# EAGLE design LoRa Mini Dev v1.1 (EAGLE 7.5.0)
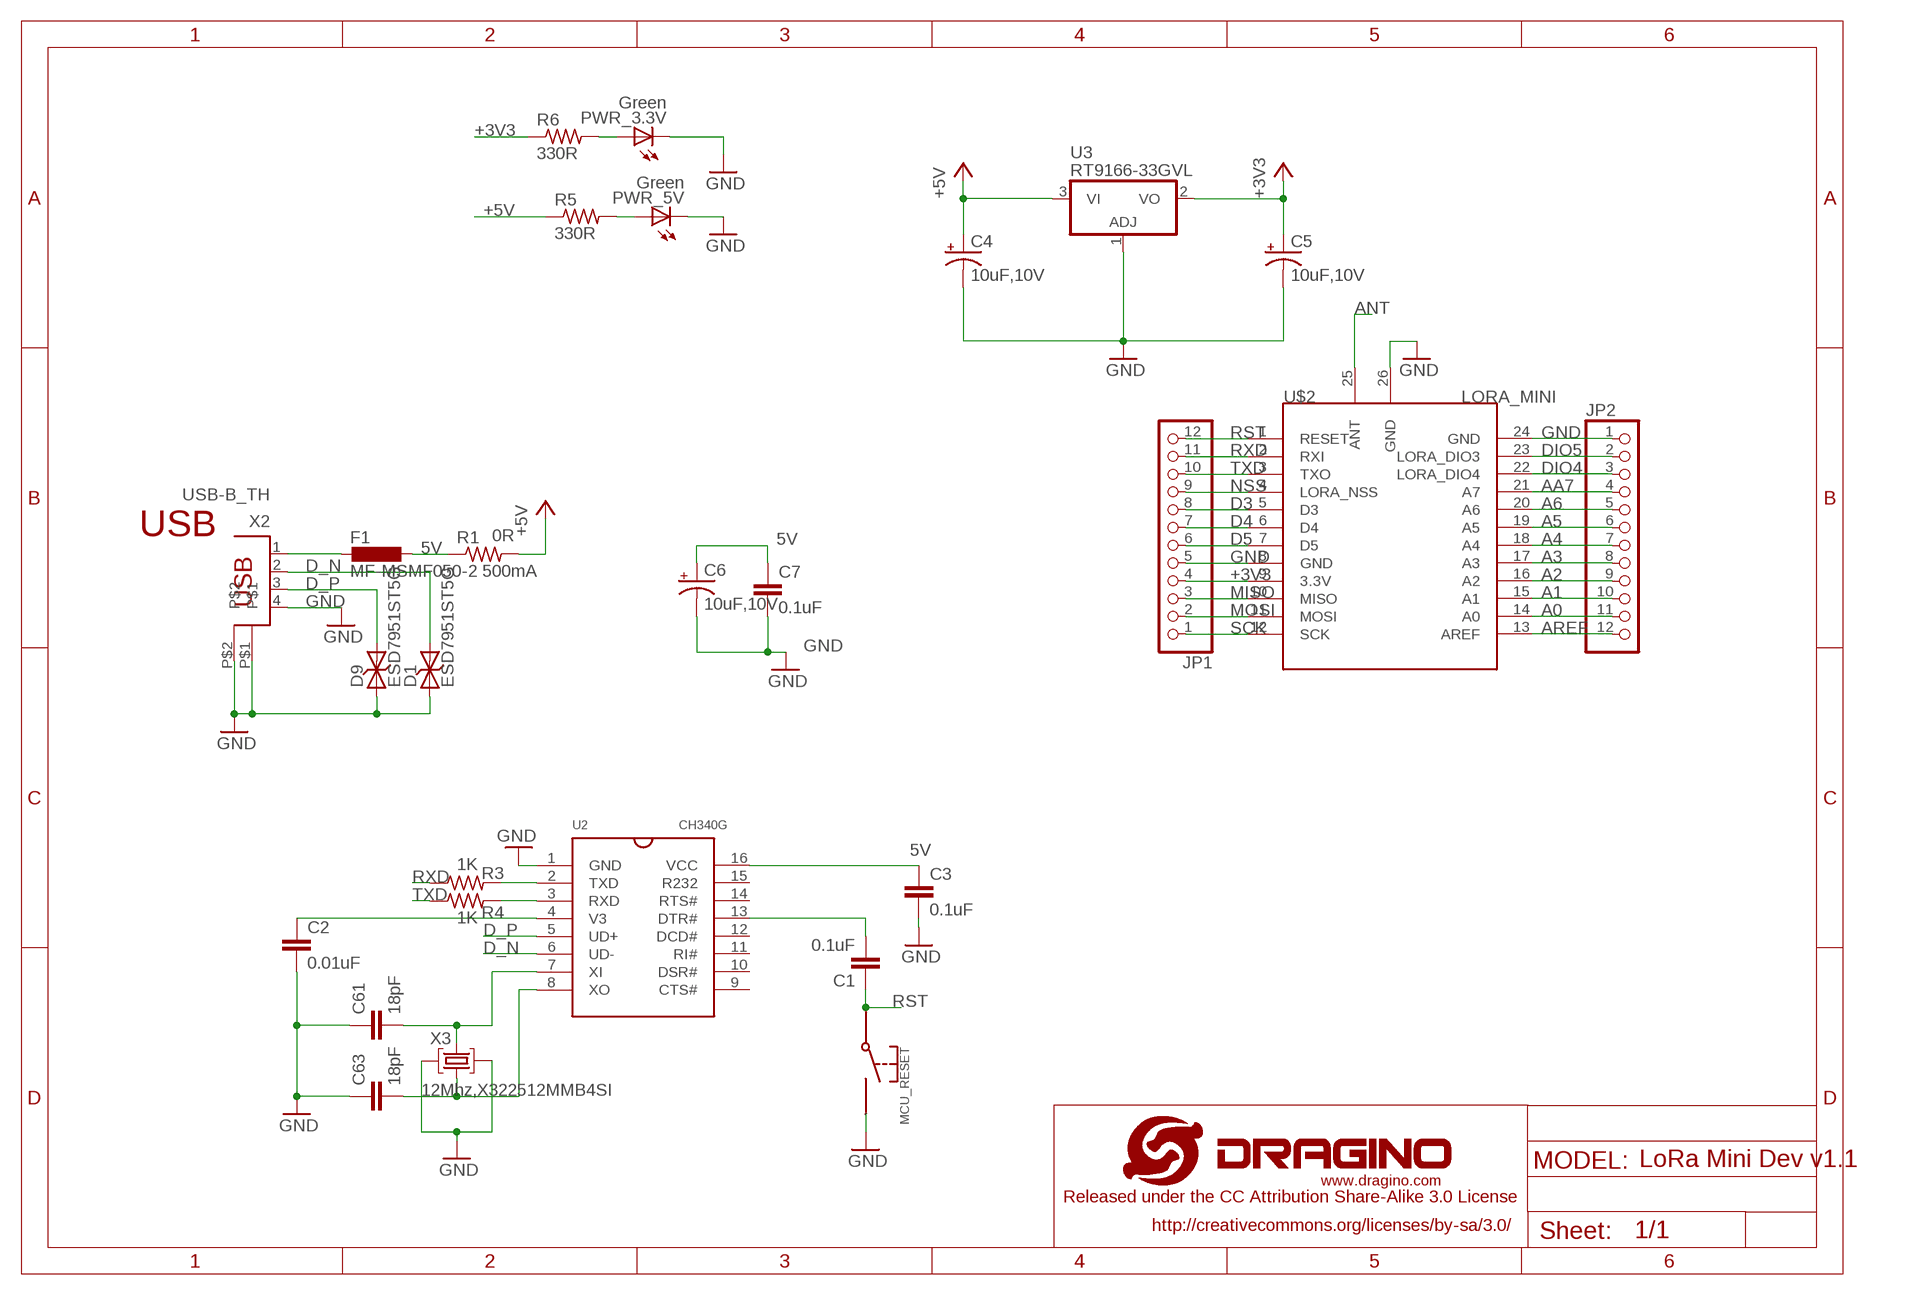
[diagram p0: schematic, sheet 1]

## Parts
C1  0.1uF  C-EUC0402  [C0402]
C2  0.01uF  C-EUC0402  [C0402]
C3  0.1uF  C-EUC0402  [C0402]
C4  10uF,10V  CPOL-USSMCA  [SMC_A]
C5  10uF,10V  CPOL-USSMCA  [SMC_A]
C6  10uF,10V  CPOL-USSMCA  [SMC_A]
C7  0.1uF  C-EUC0402  [C0402]
C61  18pF  C-EUC0402  [C0402]
C63  18pF  C-EUC0402  [C0402]
D1  ESD7951ST5G  TVSSOD−923  [SOD−923]
D9  ESD7951ST5G  TVSSOD−923  [SOD−923]
F1  MF-MSMF050-2 500mA  L-EUL1812  [L1812]
JP1  PINHD-1X12  [1X12]
JP2  PINHD-1X12  [1X12]
MCU_RESET  SWITCH  [SWITCH_3X6X5MM]
PWR_3.3V  Green  DRAGINO_LEDCHIPLED_0603  [DRAGINO_CHIPLED_0603]
PWR_5V  Green  DRAGINO_LEDCHIPLED_0603  [DRAGINO_CHIPLED_0603]
R1  0R  R-US_M0805  [M0805]
R3  1K  R-US_R0402  [R0402]
R4  1K  R-US_R0402  [R0402]
R5  330R  R-US_R0402  [R0402]
R6  330R  R-US_R0402  [R0402]
U2  CH340G  [CH340G]
U3  RT9166-33GVL  RT9166/A  [SOT23]
U$1  LOGO-NEW  [LOGO-SILK-NEW]
U$2  LORA_MINI  LORA_MINIB  [LORA_MINI_PCB]
X2  USB-B_TH  PN61729  [PN61729]
X3  12Mhz,X322512MMB4SI  CRYSTAL  [SMARTPRJ_CRYSTAL-3.2-2.5]

## Nets
5V: C3.1 C6.+ C7.1 F1.1 R1.1 U2.16(VCC)
+3V3: C5.+ JP1.4 R6.1 U3.2(VO) U$2.9(3.3V)
+5V: C4.+ R1.2 R5.1 U3.3(VI)
A0: JP2.11 U$2.14(A0)
A1: JP2.10 U$2.15(A1)
A2: JP2.9 U$2.16(A2)
A3: JP2.8 U$2.17(A3)
A4: JP2.7 U$2.18(A4)
A5: JP2.6 U$2.19(A5)
A6: JP2.5 U$2.20(A6)
AA7: JP2.4 U$2.21(A7)
ANT: U$2.25(ANT)
AREF: JP2.12 U$2.13(AREF)
CLK_N: C63.2 U2.8(XO) X3.1(C1)
CLK_P: C61.2 U2.7(XI) X3.3(C2)
D3: JP1.8 U$2.5(D3)
D4: JP1.7 U$2.6(D4)
D5 [gnd]: JP1.6 U$2.7(D5)
D_N: D1.P$2 U2.6(UD-) X2.2
D_P: D9.P$2 U2.5(UD+) X2.3
DIO4: JP2.3 U$2.22(LORA_DIO4)
DIO5: JP2.2 U$2.23(LORA_DIO3)
DTR: C1.2 U2.13(DTR#)
GND [gnd]: C2.2 C3.2 C4.- C5.- C6.- C7.2 C61.1 C63.1 D1.P$1 D9.P$1 JP1.5 JP2.1 MCU_RESET.P$2 PWR_3.3V.C PWR_5V.C U2.1(GND) U3.1(ADJ) U$2.8(GND) U$2.24(GND) U$2.26(GND) X2.4 X2.P$1 X2.P$2 X3.2(GND) X3.4(GND)
MISO: JP1.3 U$2.10(MISO)
MOSI: JP1.2 U$2.11(MOSI)
N$1: PWR_3.3V.A R6.2
N$2: F1.2 X2.1
N$5: R3.2 U2.2(TXD)
N$8: R4.2 U2.3(RXD)
N$9: PWR_5V.A R5.2
N$10: C2.1 U2.4(V3)
NSS: JP1.9 U$2.4(LORA_NSS)
RST: C1.1 JP1.12 MCU_RESET.P$1 U$2.1(RESET)
RXD: JP1.11 R3.1 U$2.2(RXI)
SCK: JP1.1 U$2.12(SCK)
TXD: JP1.10 R4.1 U$2.3(TXO)
Unconnected: U2.9(CTS#) U2.10(DSR#) U2.11(RI#) U2.12(DCD#) U2.14(RTS#) U2.15(R232)

## Notes on the sheet
- USB

## Library data of the parts
C1-C3 C7 C61 C63 = dragino-passive:C-EU: CAPACITOR, European symbol
C4-C6 = rcl:CPOL-US: POLARIZED CAPACITOR, American symbol
D1 D9 = dragino:TVS: DIODE
F1 = rcl:L-EU: INDUCTOR, European symbol
JP1 JP2 = pinhead:PINHD-1X12: PIN HEADER
MCU_RESET = dragino:SWITCH
PWR_3.3V PWR_5V = Lora Shield v1.1.1:DRAGINO_LED: LED OSRAM: - CHIPLED LG R971, LG N971, LY N971, LG Q971, LY Q971, LO R971, LY R971 LH N974, LH R974 LS Q976, LO Q976, LY Q976 LO Q996 - Hyper CHIPLED LW Q18S LB Q993, LB Q99A, LB R99A - SideLED LS A670, LO A670, LY A670, LG A670, LP A670 LB A673, LV A673, LT A673, LW A673 LH A674 LY A675 LS A676, LA A676, LO A676, LY A676, LW A676 LS A679, LY A679, LG A679 - Hyper Micro SIDELED? LS Y876, LA Y876, LO Y876, LY Y876 LT Y87S - SmartLED LW L88C, LW L88S LB L89C, LB L89S, LG L890 LS L89K, LO L89K, LY L89K LS L896, LA L896, LO L896, LY L896 - TOPLED LS T670, LO T670, LY T670, LG T670, LP T670 LSG T670, LSP T670, LSY T670, LOP T670, LYG T670 LG T671, LOG T671, LSG T671 LB T673, LV T673, LT T673, LW T673 LH T674 LS T676, LA T676, LO T676, LY T676, LB T676, LH T676, LSB T676, LW T676 LB T67C, LV T67C, LT T67C, LS T67K, LO T67K, LY T67K, LW E67C LS E67B, LA E67B, LO E67B, LY E67B, LB E67C, LV E67C, LT E67C LW T67C LS T679, LY T679, LG T679 LS T770, LO T770, LY T770, LG T770, LP T770 LB T773, LV T773, LT T773, LW T773 LH T774 LS E675, LA E675, LY E675, LS T675 LS T776, LA T776, LO T776, LY T776, LB T776 LHGB T686 LT T68C, LB T68C - Hyper Mini TOPLED? LB M676 - Mini TOPLED Santana? LG M470 LS M47K, LO M47K, LY M47K Source: http://www.osram.convergy.de LUXEON: - LUMILED? LXK2-PW12-R00, LXK2-PW12-S00, LXK2-PW14-U00, LXK2-PW14-V00 LXK2-PM12-R00, LXK2-PM12-S00, LXK2-PM14-U00 LXK2-PE12-Q00, LXK2-PE12-R00, LXK2-PE12-S00, LXK2-PE14-T00, LXK2-PE14-U00 LXK2-PB12-K00, LXK2-PB12-L00, LXK2-PB12-M00, LXK2-PB14-N00, LXK2-PB14-P00, LXK2-PB14-Q00 LXK2-PR12-L00, LXK2-PR12-M00, LXK2-PR14-Q00, LXK2-PR14-R00 LXK2-PD12-Q00, LXK2-PD12-R00, LXK2-PD12-S00 LXK2-PH12-R00, LXK2-PH12-S00 LXK2-PL12-P00, LXK2-PL12-Q00, LXK2-PL12-R00 Source: www.luxeon.com KINGBRIGHT: KA-3528ASYC Source: www.kingbright.com
R1 R3-R6 = dragino:R-US_: RESISTOR, American symbol
U2 = dragino:CH340G
U3 = linear:RT9166/A
U$1 = dragino:LOGO-NEW
U$2 = dragino:LORA_MINI
X2 = SmartPrj:PN61729: BERG USB connector
X3 = dragino-passive:CRYSTAL

## Net classes
0 default: width 0.203 mm, clearance 0.203 mm
1 vcc: width 0.254 mm
2 gnd: width 0.305 mm, drill 0.254 mm, clearance 0.203 mm
3 usbvcc: width 0.254 mm, drill 0.61 mm, clearance 0.254 mm
5 usbtrace: width 0.254 mm, clearance 0.152 mm
6 usbtrace-4layer: width 0.191 mm, clearance 0.203 mm

## Board
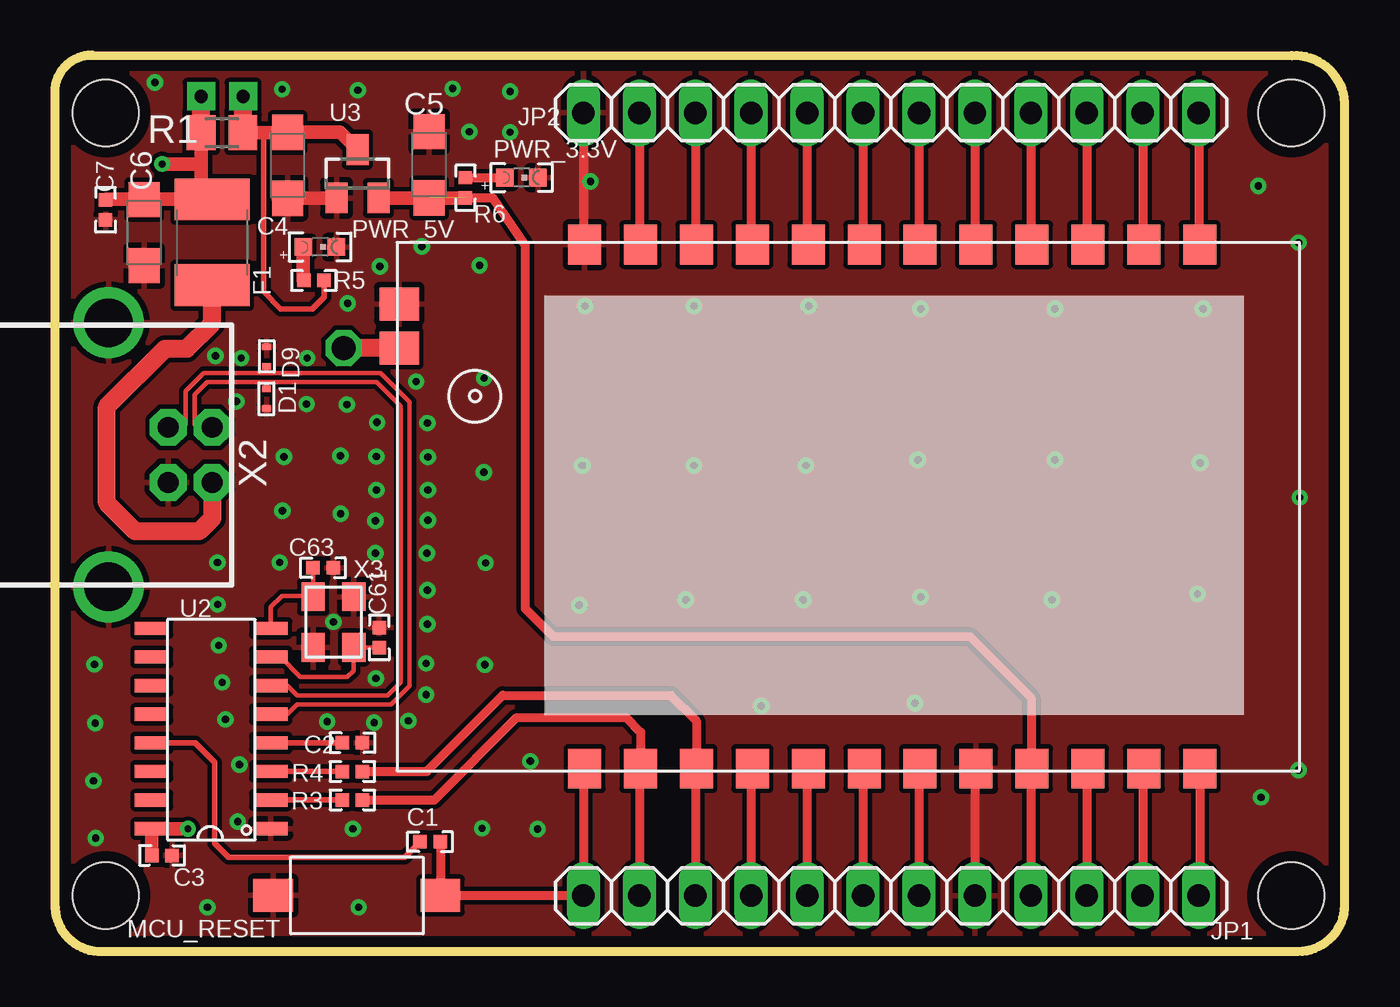
[diagram p1: board, top side]
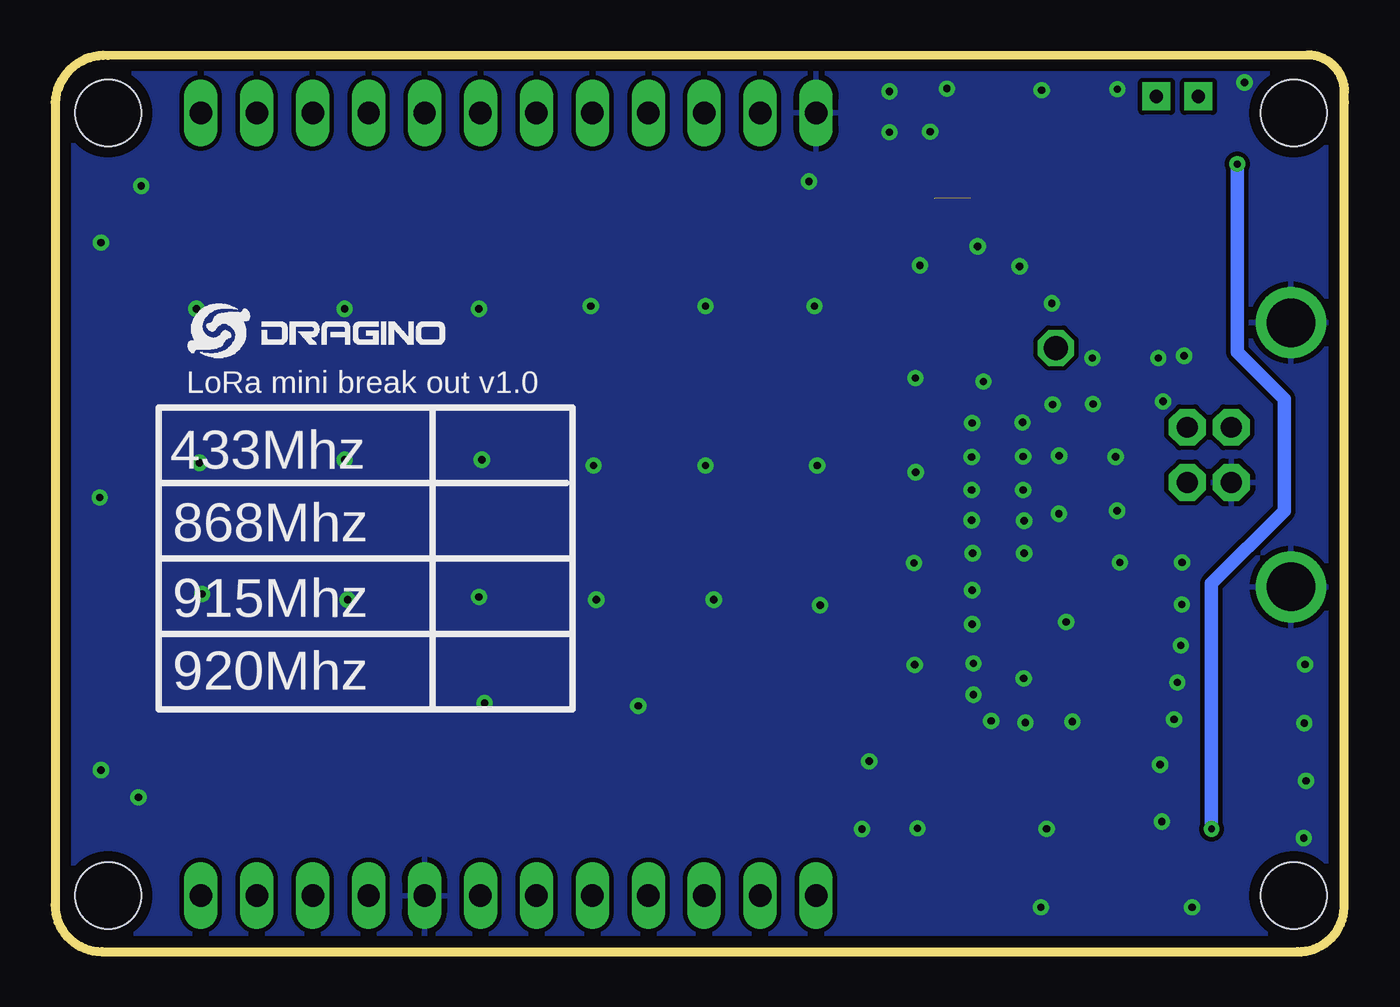
[diagram p2: board, bottom side, seen from below]

Size 58.56 x 40.73 mm. Coordinates in mm from the lower left corner, seen from the top.
Outline: 0,38.57 0,39.06 arc-90 1.67,40.73 56.17,40.71 arc-90 58.56,38.57 58.56,2.12 arc-90 56.44,0 2.14,0 arc-90 0.02,1.99 0,38.57
Copper layers (1*16): Top 0.035mm / dielectric 1.5mm / Bottom 0.035mm
Design rules "default *": minimum track width 8mil, minimum drill 12mil, track to track 8mil, track to pad 8mil, pad to pad 8mil, via to via 10mil, smd to smd 8mil, copper to edge 20mil, drill to drill 8mil, minimum pad ring 10mil, minimum via ring 8mil, stop-mask expansion 1mil, vias tented up to drill 30mil, thermal gap 10mil
Holes 3 mm at 56.15,38.1 56.15,2.54 2.3,2.54 2.3,38.1

### Footprints (pad centres in the part's own frame; a part is rotated, then mirrored left to right if it is on the bottom)
C0402 = smd 0.61 x 0.61: 1 -0.457,0; 2 0.457,0
SMC_A = smd 1.6 x 1.4: + -1.5,0; - 1.5,0
SOD−923 = smd 0.3 x 0.4: P$1 -0.45,0; P$2 0.45,0
L1812 = smd 1.9 x 3.4: 1 -1.95,0; 2 1.95,0
1X12 = drill 1.016 long: 1 -13.97,0; 2 -11.43,0; 3 -8.89,0; 4 -6.35,0; 5 -3.81,0; 6 -1.27,0; 7 1.27,0; 8 3.81,0; 9 6.35,0; 10 8.89,0; 11 11.43,0; 12 13.97,0
SWITCH_3X6X5MM = smd 1.8 x 1.5: P$1 -3.8,0; P$2 3.8,0
DRAGINO_CHIPLED_0603 = smd 0.8 x 0.8: A 0,-0.75; C 0,0.75
M0805 = smd 1.3 x 1.6: 1 -0.95,0; 2 0.95,0
R0402 = smd 0.61 x 0.61: 1 -0.457,0; 2 0.457,0
CH340G = smd 1.55 x 0.6: 1 -2.7,4.5; 2 -2.7,3.2; 3 -2.7,1.9; 4 -2.7,0.6; 5 -2.7,-0.7; 6 -2.7,-2; 7 -2.7,-3.3; 8 -2.7,-4.6; 9 2.7,-4.6; 10 2.7,-3.3; 11 2.7,-2; 12 2.7,-0.7; 13 2.7,0.6; 14 2.7,1.9; 15 2.7,3.2; 16 2.7,4.5
SOT23 = smd 1 x 1.4: 1 -0.95,-1.1; 2 0.95,-1.1; 3 0,1.1
LORA_MINI_PCB = smd 1.8 x 1.5: 1 0.1,32.48; 2 0.1,29.94; 3 0.1,27.4; 4 0.1,24.86; 5 0.1,22.32; 6 0.1,19.78; 7 0.1,17.24; 8 0.1,14.7; 9 0.1,12.16; 10 0.1,9.62; 11 0.1,7.08; 12 0.1,4.54; 13 23.9,4.54; 14 23.9,7.08; 15 23.9,9.62; 16 23.9,12.16; 17 23.9,14.7; 18 23.9,17.24; 19 23.9,19.78; 20 23.9,22.32; 21 23.9,24.86; 22 23.9,27.4; 23 23.9,29.94; 24 23.9,32.48 | smd 1.5 x 1.8: 25 19.2,40.9; 26 21.2,40.9
PN61729 = drill 0.95 pad 1.676 octagon: 1 1.25,4.71; 2 -1.25,4.71; 3 -1.25,2.71; 4 1.25,2.71 | drill 2.2: P$1 -6,0; P$2 6,0
SMARTPRJ_CRYSTAL-3.2-2.5 = smd 1.3 x 1.05: 1 -1.15,-0.925; 2 1.15,-0.925; 3 1.15,0.925; 4 -1.15,0.925

### Placement (x,y rotation side)
C1  17.04,4.99 180 top
C2  13.51,9.49 0 top
C3  4.86,4.37 0 top
C4  10.56,35.72 270 top
C5  16.99,35.74 90 top
C6  4.05,32.66 270 top
C7  2.3,33.7 270 top
C61  14.72,14.26 270 top
C63  12.18,17.43 180 top
D1  9.6,25.12 90 top
D9  9.62,27.03 270 top
F1  7.13,32.22 270 top
JP1  37.97,2.54 180 top
JP2  37.97,38.1 0 top
MCU_RESET  13.71,2.55 180 top
PWR_3.3V  21.18,35.16 270 top
PWR_5V  12.03,32.01 270 top
R1  7.59,37.2 0 top
R3  13.51,6.89 180 top
R4  13.5,8.18 180 top
R5  11.75,30.48 180 top
R6  18.64,34.7 90 top
U2  7.09,10.09 180 top
U3  13.74,35.34 0 top
U$1  52.55,26.97 0 bottom
U$2  56.53,8.22 90 top
X2  2.43,22.57 270 top
X3  12.65,14.97 270 top

### Tracks (layer width: path | path; a pad name or v marks a point on that pad's centre or on a via)
5V  (via drill 0.3, 0.6 pad 1.27)
  Top 0.61: F1.1 6.49,34.17 | 6.49,34.17 4.01,34.17 | 4.01,34.17 2.32,34.17 C7.1 | C6.+ 4.02,34.16 4.01,34.17 | R1.1 6.64,35.77 | 6.64,35.77 6.64,34.31 6.49,34.17 | C3.1 U2.16 6.03,5.59 v6.04,5.57 | v4.87,35.77 6.64,35.77
  Top 0.813: R1.1 v6.64,38.85 v6.63,38.85
  Bottom 0.61: v6.04,5.57 6.04,16.72 2.73,20.03 2.73,25.11 4.87,27.24 v4.87,35.77
+3V3  (1 unrouted)
  Top 0.406: JP1.4 44.32,8.32 U$2.9 44.34,8.35 44.34,11.52 41.55,14.31 22.62,14.31 21.35,15.58 21.35,32.09 19.86,34.24 R6.1
  Top 0.61: U3.2 R6.1
+5V  (via drill 0.6 pad 1.27)
  Top 0.254: R5.1 12.21,29.73 11.68,29.2 10.25,29.2 9.47,29.98 9.47,37.05 9.62,37.2
  Top 0.61: R1.2 9.62,37.2 10.54,37.2 C4.+ 12.96,37.22 U3.3
  Top 0.813: R1.2 v8.54,38.85
A0
  Top 0.406: JP2.11 49.4,32.17 U$2.14
A1
  Top 0.406: JP2.10 46.86,32.17 U$2.15
A2
  Top 0.406: JP2.9 44.32,32.17 U$2.16
A3
  Top 0.406: JP2.8 41.78,32.17 U$2.17
A4
  Top 0.406: JP2.7 39.24,32.17 U$2.18
A5
  Top 0.406: JP2.6 36.7,32.17 U$2.19
A6
  Top 0.406: JP2.5 34.16,32.17 U$2.20
AA7
  Top 0.406: JP2.4 31.62,32.17 U$2.21
ANT  (via drill 1.09)
  Top 0.813: U$2.25 v13.1,27.42
AREF
  Top 0.406: JP2.12 51.94,32.17 U$2.13
CLK_N
  Top 0.203: U2.8 9.8,15.66 10.3,16.17 11.67,16.17 X3.1 C63.2
CLK_P
  Top 0.203: U2.7 10.24,13.39 11.14,12.48 13.28,12.48 13.56,12.76 13.56,13.8 X3.3 14.71,13.82 C61.2
D3
  Top 0.406: U$2.5 34.16,8.32 JP1.8
D4
  Top 0.406: U$2.6 36.7,8.32 JP1.7
D5
  Top 0.406: U$2.7 39.24,8.32 JP1.6
D_N
  Top 0.203: X2.2 6.46,23.82 6.34,23.94 6.34,25.3 6.91,25.87 9.62,25.87 | U2.6 10.55,12.09 10.99,11.64 15.1,11.64 15.69,12.24 15.69,24.79 14.61,25.87 9.62,25.87 | D1.P$2 9.6,25.85 9.62,25.87
D_P
  Top 0.203: X2.3 5.81,23.82 5.94,23.94 5.94,25.47 6.74,26.27 9.62,26.27 | U2.5 10.54,10.79 10.99,11.24 15.27,11.24 16.1,12.07 16.1,24.96 14.78,26.27 9.62,26.27 | D9.P$2 9.62,26.27 | 9.62,26.27
DIO4
  Top 0.406: JP2.3 29.08,32.17 U$2.22
DIO5
  Top 0.406: JP2.2 26.54,32.17 U$2.23
DTR
  Top 0.254: U2.13 6.37,9.49 7.26,8.6 7.26,4.91 7.89,4.28 15.87,4.28 C1.2
GND  (via drill 0.33)
  Top 0.305: X3.2 11.72,14.27
  Top 0.406: JP2.1 24,32.17 U$2.24 | U$2.8 41.78,8.32 JP1.5
  Top 0.61: C4.- 12.77,34.22 U3.1
  other vias: 8.3,5.9 8.37,8.5 16.66,32.03 20.67,39.08 20.67,37.22 16.91,24.01 13.29,29.45 18.05,39.2 13.76,39.13 24.32,34.99 4.54,39.48 10.32,39.18 16.93,22.47 14.75,31.13 19.28,31.18 16.4,25.89 16.93,20.97 19.52,13.03 14.62,24.04 14.6,22.49 1.85,5.16 6.93,2.02 13.78,2.02 13.53,5.57 7.38,15.77 7.43,13.91 7.74,10.55 1.74,7.76 24.07,29.32 29.02,29.32 34.23,29.32 39.31,29.2 45.41,29.2 52.14,29.2 23.94,22.08 23.82,15.73 29.02,22.08 28.64,15.99 34.1,22.08 33.98,15.99 39.18,22.34 39.31,16.12 45.41,22.34 45.28,15.99 52.01,22.21 51.88,16.24 56.53,20.62 56.48,8.24 32.07,11.16 39.06,11.29 54.65,34.78 56.48,32.21 7.37,17.68 10.39,22.48 11.42,24.88 13.25,24.85 18.81,37.25 14.6,20.97 14.55,19.57 14.55,18.1 16.93,19.6 16.88,18.1 16.91,16.42 16.91,14.87 16.86,13.09 16.86,11.67 16.04,10.48 14.5,10.4 12.36,10.45 14.57,12.41 12.64,14.97 7.28,27.06 8.23,24.99 8.45,26.96 11.45,26.96 10.33,20.03 12.97,19.89 10.2,17.68 19.47,21.78 19.55,17.65 19.49,26.06 7.59,12.23 1.8,13.04 1.82,10.37 21.58,8.65 21.91,5.56 19.4,5.6 12.96,22.53 54.78,7.01
  pour Top (rank 2): 59.45,41.49 59.45,-0.55 -0.49,-0.55 -0.49,41.49
  pour Bottom (rank 2): -0.49,41.49 59.45,41.49 59.45,-0.55 -0.49,-0.55
MISO
  Top 0.406: U$2.10 46.86,8.32 JP1.3
MOSI
  Top 0.406: U$2.11 49.4,8.32 JP1.2
N$1
  Top 0.406: R6.2 PWR_3.3V.A
N$2
  Top 0.813: X2.1 7.14,19.68 6.55,19.09 3.65,19.09 2.35,20.38 2.35,24.75 5,27.39 5.99,27.39 7.13,28.54 F1.2
N$5
  Top 0.254: U2.2 R3.2
N$8
  Top 0.254: U2.3 R4.2
N$9
  Top 0.61: PWR_5V.A 11.28,30.5 R5.2
N$10
  Top 0.254: U2.4 C2.1
NSS
  Top 0.406: U$2.4 31.62,8.32 JP1.9
RST
  Top 0.406: C1.1 17.51,4.99 MCU_RESET.P$1 24,2.55 JP1.12 24,8.32 U$2.1
RXD
  Top 0.406: JP1.11 26.54,8.32 U$2.2 26.59,9.96 25.93,10.63 20.97,10.63 17.23,6.89 R3.1
SCK
  Top 0.406: U$2.12 51.99,2.59 JP1.1
TXD
  Top 0.406: JP1.10 29.08,8.32 U$2.3 29.13,10.47 27.96,11.64 20.34,11.64 16.88,8.18 R4.1

### Text on the board
bPlace: LoRa mini break out v1.0 | 433Mhz | 868Mhz | 915Mhz | 920Mhz